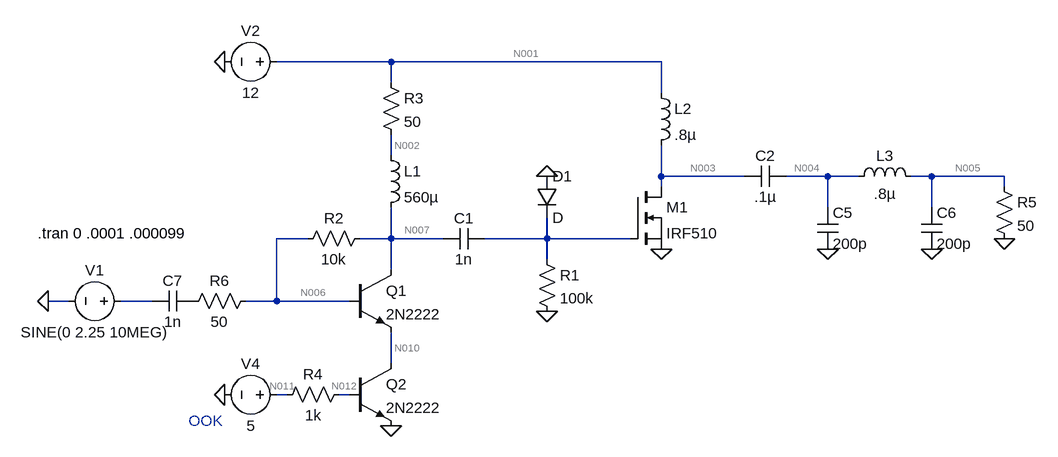
[diagram p0: schematic Draft3.asc]
Draft3.asc, the LTspice schematic file:
Version 4
SHEET 1 880 680
WIRE -592 -160 -768 -160
WIRE -176 -160 -592 -160
WIRE -592 -128 -592 -160
WIRE -176 -112 -176 -160
WIRE -592 -16 -592 -48
WIRE -176 16 -176 -32
WIRE -48 16 -176 16
WIRE 80 16 16 16
WIRE 128 16 80 16
WIRE 240 16 208 16
WIRE 352 16 240 16
WIRE -176 32 -176 16
WIRE 352 32 352 16
WIRE 80 64 80 16
WIRE 240 64 240 16
WIRE -720 112 -768 112
WIRE -592 112 -592 64
WIRE -592 112 -640 112
WIRE -512 112 -592 112
WIRE -352 112 -352 80
WIRE -352 112 -448 112
WIRE -224 112 -352 112
WIRE -352 144 -352 112
WIRE -592 160 -592 112
WIRE -1088 208 -1120 208
WIRE -960 208 -1008 208
WIRE -768 208 -768 112
WIRE -768 208 -816 208
WIRE -656 208 -768 208
WIRE -592 304 -592 256
WIRE -752 352 -768 352
WIRE -656 352 -672 352
FLAG -1120 208 0
FLAG 80 128 0
FLAG 240 128 0
FLAG 352 112 0
FLAG -848 -160 0
FLAG -176 128 0
FLAG -592 400 0
FLAG -848 352 0
FLAG -352 224 0
FLAG -352 16 0
SYMBOL voltage -992 208 R90
WINDOW 0 -32 56 VBottom 2
WINDOW 3 32 56 VTop 2
WINDOW 123 0 0 Left 0
WINDOW 39 0 0 Left 0
SYMATTR InstName V1
SYMATTR Value SINE(0 2.25 10MEG)
SYMBOL cap 16 0 R90
WINDOW 0 0 32 VBottom 2
WINDOW 3 32 32 VTop 2
SYMATTR InstName C2
SYMATTR Value .1µ
SYMBOL cap 64 64 R0
SYMATTR InstName C5
SYMATTR Value 200p
SYMBOL ind 112 32 R270
WINDOW 0 32 56 VTop 2
WINDOW 3 5 56 VBottom 2
SYMATTR InstName L3
SYMATTR Value .8µ
SYMBOL cap 224 64 R0
SYMATTR InstName C6
SYMATTR Value 200p
SYMBOL res 336 16 R0
SYMATTR InstName R5
SYMATTR Value 50
SYMBOL cap -896 192 R90
WINDOW 0 0 32 VBottom 2
WINDOW 3 32 32 VTop 2
SYMATTR InstName C7
SYMATTR Value 1n
SYMBOL npn -656 160 R0
SYMATTR InstName Q1
SYMATTR Value 2N2222
SYMBOL res -624 96 R90
WINDOW 0 0 56 VBottom 2
WINDOW 3 32 56 VTop 2
SYMATTR InstName R2
SYMATTR Value 10k
SYMBOL voltage -752 -160 R90
WINDOW 0 -32 56 VBottom 2
WINDOW 3 32 56 VTop 2
WINDOW 123 0 0 Left 0
WINDOW 39 0 0 Left 0
SYMATTR InstName V2
SYMATTR Value 12
SYMBOL cap -448 96 R90
WINDOW 0 0 32 VBottom 2
WINDOW 3 32 32 VTop 2
SYMATTR InstName C1
SYMATTR Value 1n
SYMBOL nmos -224 32 R0
SYMATTR InstName M1
SYMATTR Value IRF510
SYMBOL ind -192 -128 R0
SYMATTR InstName L2
SYMATTR Value .8µ
SYMBOL res -368 128 R0
SYMATTR InstName R1
SYMATTR Value 100k
SYMBOL res -800 192 R90
WINDOW 0 0 56 VBottom 2
WINDOW 3 32 56 VTop 2
SYMATTR InstName R6
SYMATTR Value 50
SYMBOL ind -608 -32 R0
SYMATTR InstName L1
SYMATTR Value 560µ
SYMBOL res -608 -144 R0
SYMATTR InstName R3
SYMATTR Value 50
SYMBOL npn -656 304 R0
SYMATTR InstName Q2
SYMATTR Value 2N2222
SYMBOL voltage -752 352 R90
WINDOW 0 -32 56 VBottom 2
WINDOW 3 32 56 VTop 2
WINDOW 123 0 0 Left 0
WINDOW 39 0 0 Left 0
SYMATTR InstName V4
SYMATTR Value 5
SYMBOL res -656 336 R90
WINDOW 0 0 56 VBottom 2
WINDOW 3 32 56 VTop 2
SYMATTR InstName R4
SYMATTR Value 1k
SYMBOL diode -368 16 R0
SYMATTR InstName D1
TEXT -1136 104 Left 2 !.tran 0 .0001 .000099
TEXT -904 392 Left 2 ;OOK

The netlist it stands for:
* Draft3.asc
V1 N009 0 SINE(0 2.25 10MEG)
C2 N004 N003 .1µ
C5 N004 0 200p
L3 N004 N005 .8µ
C6 N005 0 200p
R5 N005 0 50
C7 P001 N009 1n
Q1 N007 N006 N010 0 2N2222
R2 N007 N006 10k
V2 N001 0 12
C1 N008 N007 1n
M1 N003 N008 0 0 IRF510
L2 N001 N003 .8µ
R1 N008 0 100k
R6 N006 P001 50
L1 N002 N007 560µ
R3 N001 N002 50
Q2 N010 N012 0 0 2N2222
V4 N011 0 5
R4 N012 N011 1k
D1 0 N008 D
.model D D
.lib standard.dio
.model NPN NPN
.model PNP PNP
.lib standard.bjt
.model NMOS NMOS
.model PMOS PMOS
.lib standard.mos
.tran 0 .0001 .000099
* OOK
.backanno
.end

* Results of the author's LTspice run, read from the files saved beside the schematic
* Operating Point, zero values left out:
*   V(n003) = 12 V
*   V(p001) = 925.9 mV
*   V(n007) = 7.029 V
*   V(n006) = 925.9 mV
*   V(n010) = 120.5 mV
*   V(n001) = 12 V
*   V(n002) = 7.029 V
*   V(n012) = 847.3 mV
*   V(n011) = 5 V
*   Ic(Q2) = 99.42 mA
*   Ib(Q2) = 4.153 mA
*   Ie(Q2) = -103.6 mA
*   Ic(Q1) = 98.81 mA
*   Ib(Q1) = 610.3 µA
*   Ie(Q1) = -99.42 mA
*   Id(M1) = 29 pA
*   Is(M1) = -29 pA
*   I(L1) = 99.42 mA
*   I(L2) = 42.63 pA
*   I(R4) = -4.153 mA
*   I(R3) = 99.42 mA
*   I(R2) = 610.3 µA
*   I(V4) = -4.153 mA
*   I(V2) = -99.42 mA
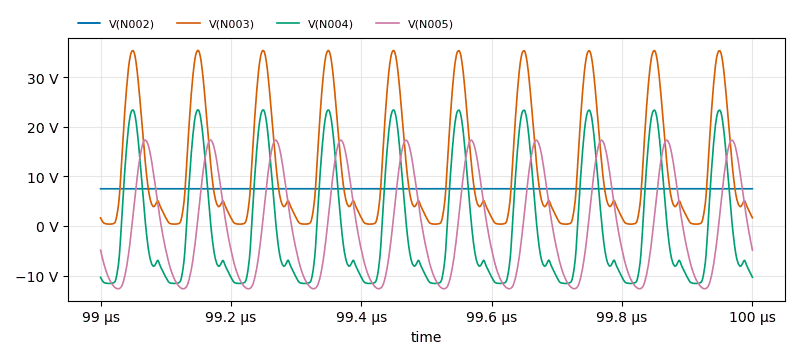
[diagram p1: Transient Analysis of Draft3.asc, plotted from the saved traces]
* Transient Analysis, 1 run:
*   V(N002): min 7.509 V, max 7.525 V, average 7.517 V, rms 7.517 V, last 7.513 V
*   V(N003): min 373.8 mV, max 35.46 V, average 12 V, rms 17.2 V, last 1.659 V
*   V(N004): min -11.6 V, max 23.46 V, average 698.5 µV, rms 12.32 V, last -10.35 V
*   V(N005): min -12.68 V, max 17.37 V, average 3.11 mV, rms 10.58 V, last -4.888 V